# EAGLE schematic full_schema (EAGLE 9.6.2)
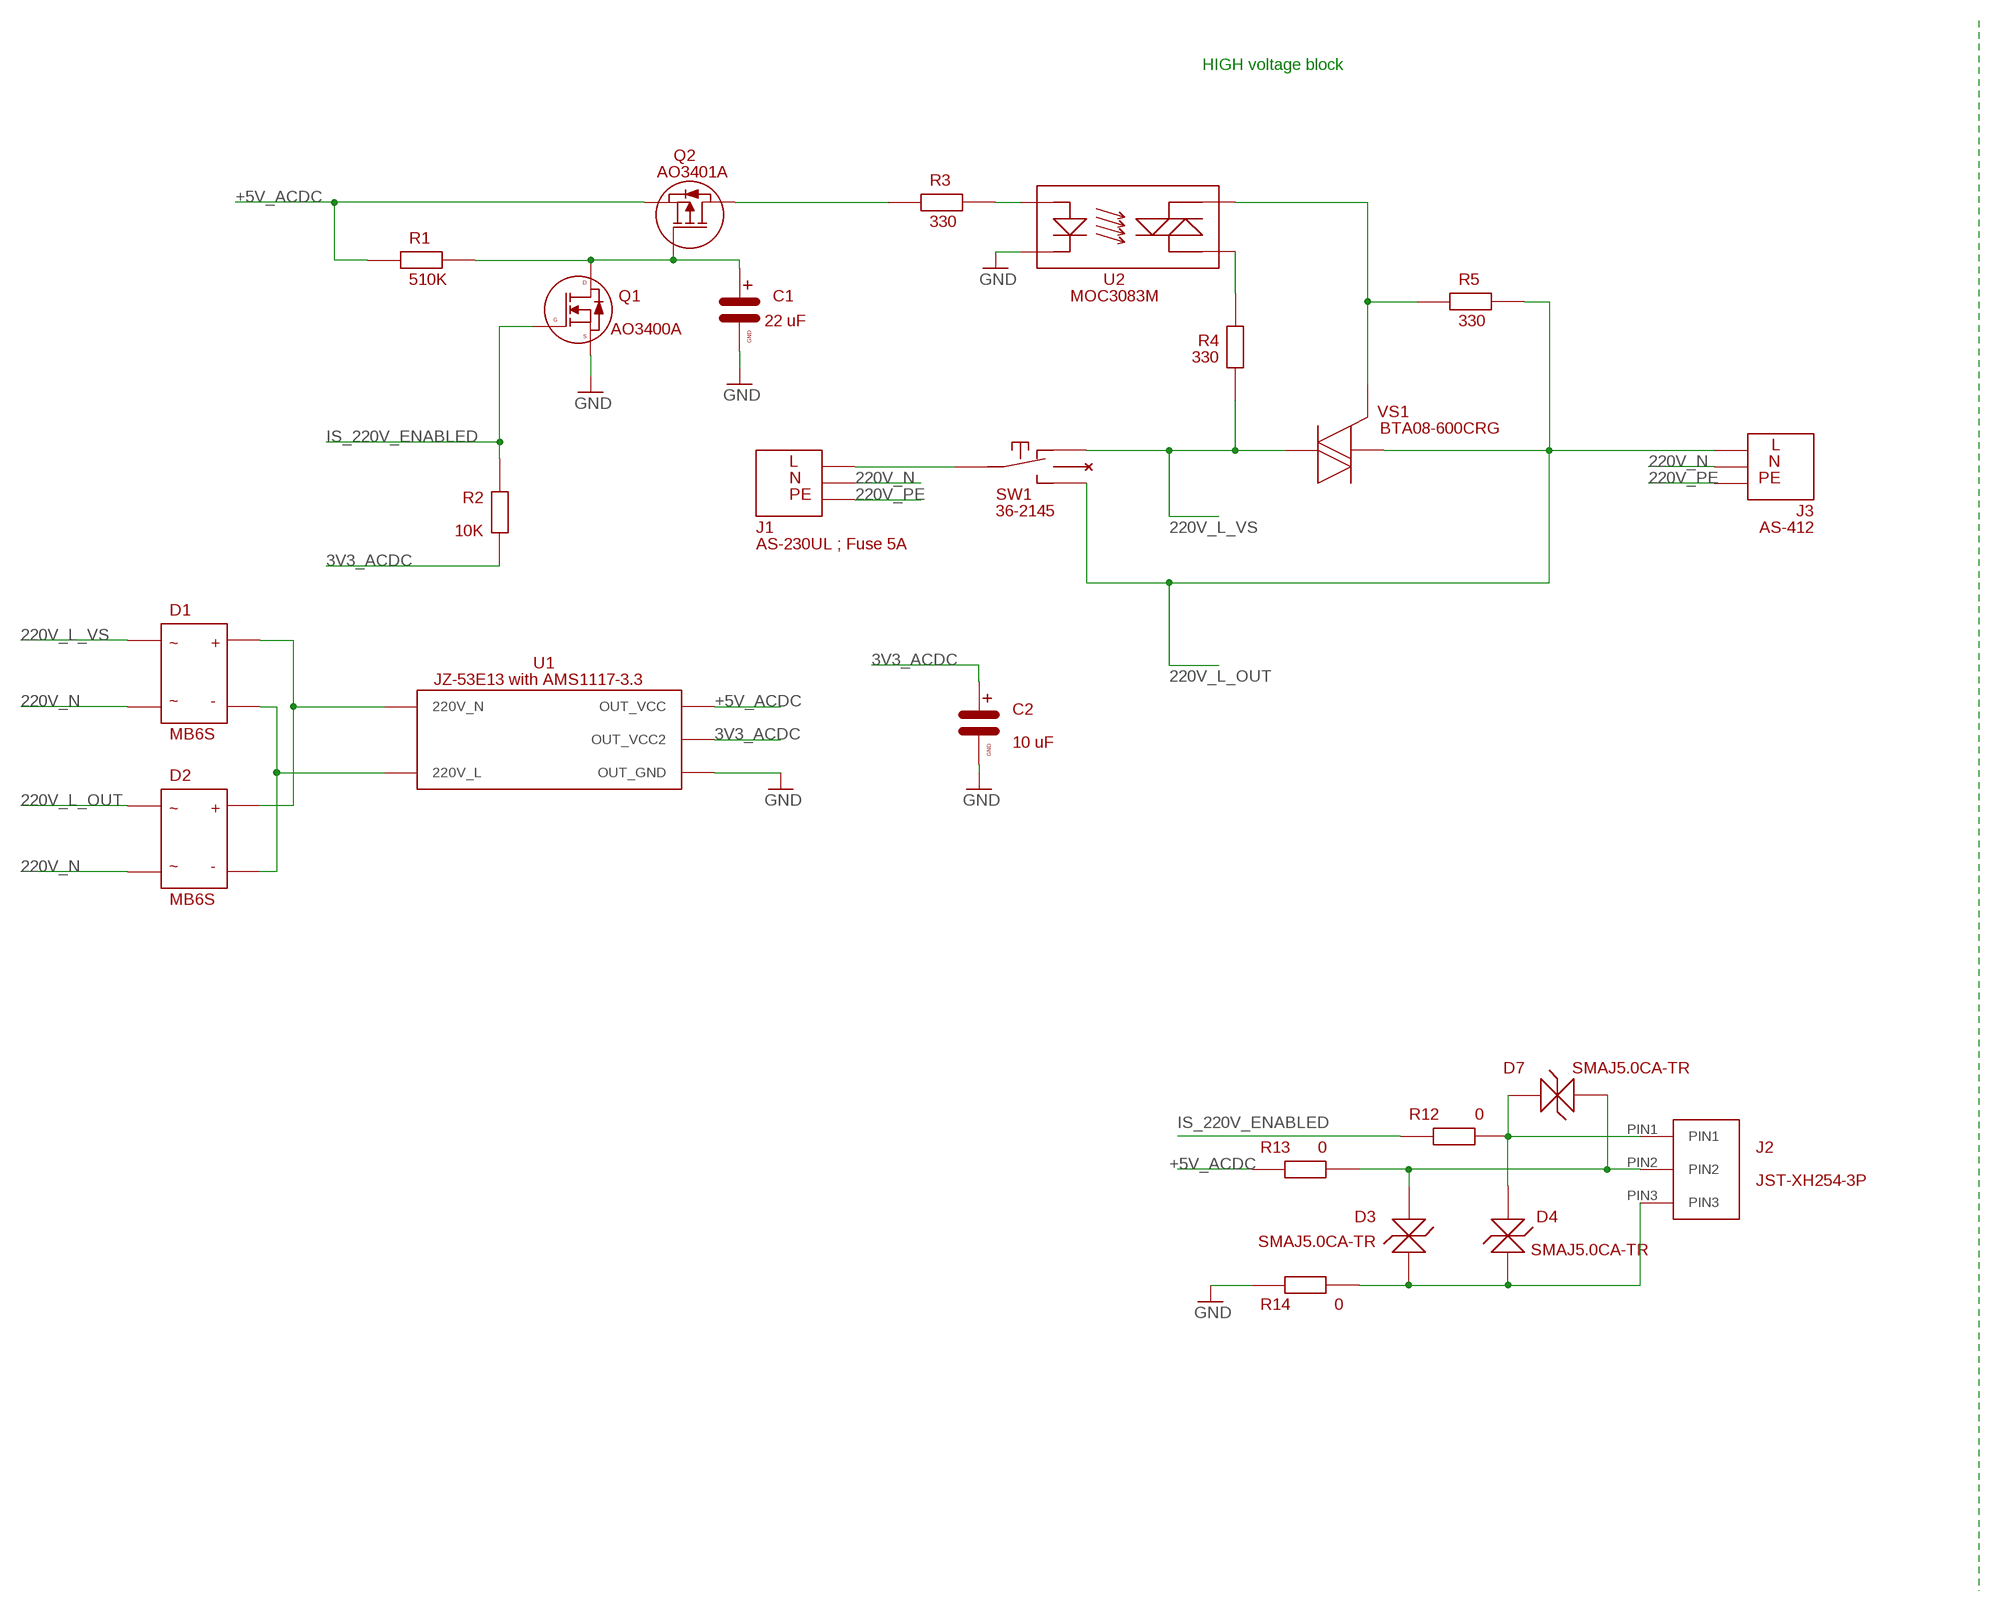
[diagram p0: schematic, sheet 1, part 1 of 2]
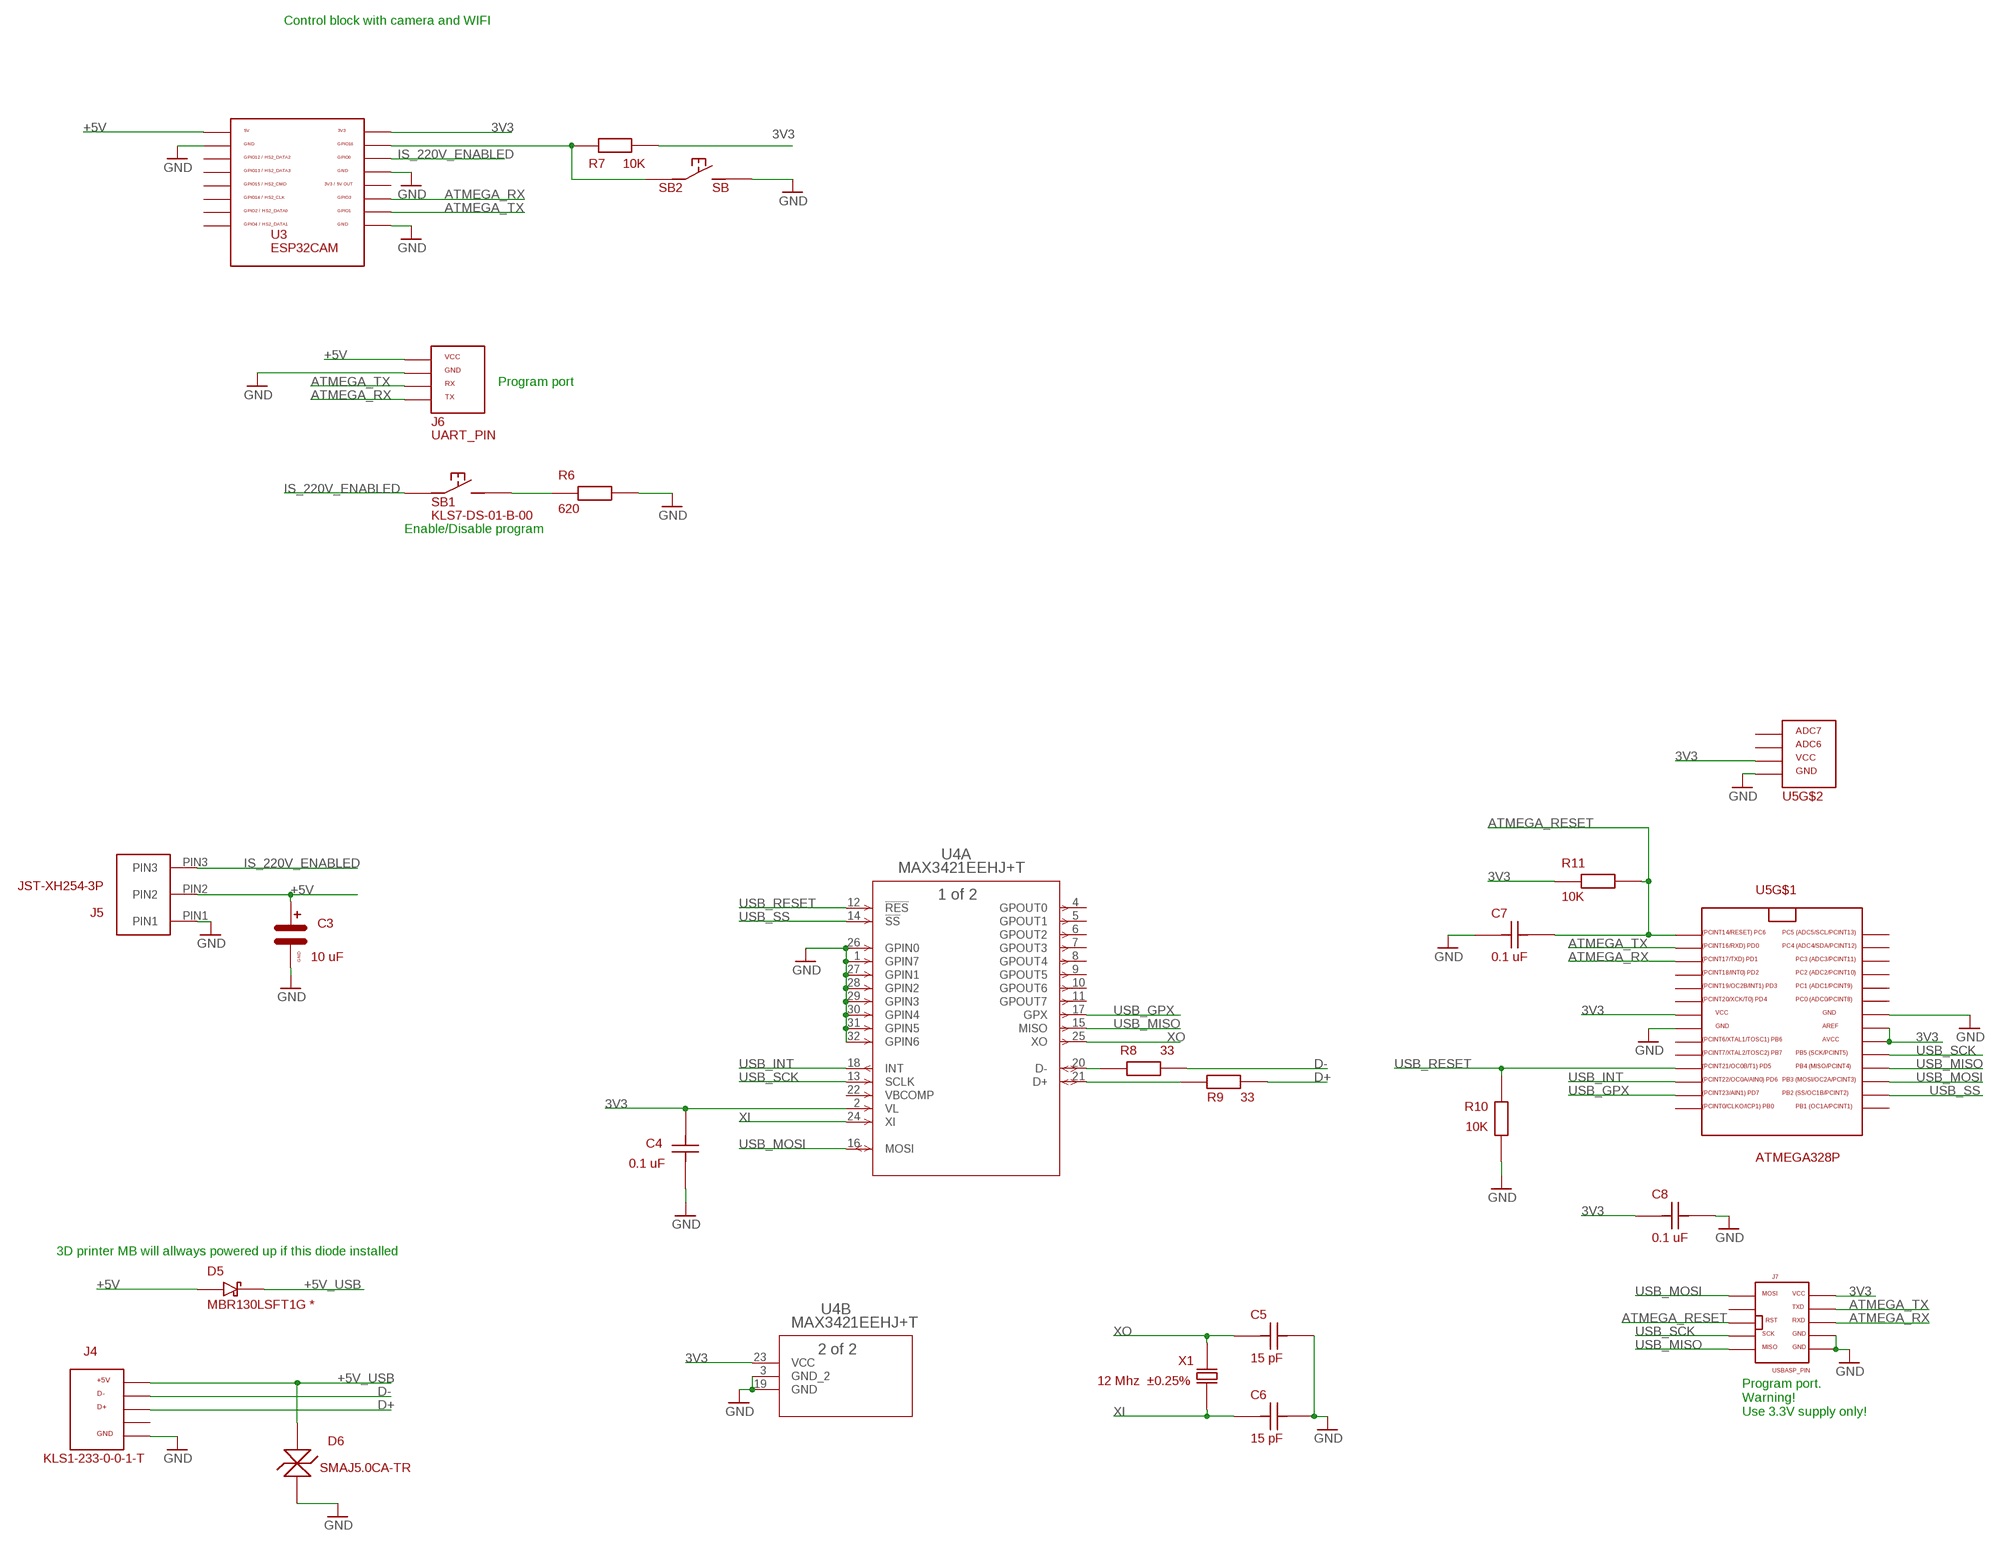
[diagram p1: schematic, sheet 1, part 2 of 2]

## Parts
C1  22 uF  CMINI-5X7  [C-MINI-5X7]
C2  10 uF  CMINI-5X7  [C-MINI-5X7]
C3  10 uF  CMINI-5X7  [C-MINI-5X7]
C4  0.1 uF  C-10805  [SMD_0805]
C5  15 pF  C-10805  [SMD_0805]
C6  15 pF  C-10805  [SMD_0805]
C7  0.1 uF  C-10805  [SMD_0805]
C8  0.1 uF  C-10805  [SMD_0805]
D1  MB6S  DIODE_BRIDGEMBS  [MBS]
D2  MB6S  DIODE_BRIDGEMBS  [MBS]
D3  SMAJ5.0CA-TR  D_ESDDO-214AC  [DO-214AC]
D4  SMAJ5.0CA-TR  D_ESDDO-214AC  [DO-214AC]
D5  MBR130LSFT1G *  D_SCHOTTKYSOD-123FL  [D-SOD-123FL]
D6  SMAJ5.0CA-TR  D_ESDDO-214AC  [DO-214AC]
D7  SMAJ5.0CA-TR  D_ESDDO-214AC  [DO-214AC]
J1  AS-230UL ; Fuse 5A  220V_CONNECTOREXT  [220V_CONNECTOR_EXTERNAL]
J2  JST-XH254-3P  [JST-XH254-3P]
J3  AS-412  220V_CONNECTOREXT  [220V_CONNECTOR_EXTERNAL]
J4  KLS1-233-0-0-1-T  J_MICROUSB  [MICROUSB]
J5  JST-XH254-3P  [JST-XH254-3P]
J6  UART_PIN  [UART_PIN]
J7  USBASP_PIN  [USBASP_PIN]
Q1  AO3400A  MOSFET_NSOT-23-3  [SOT-23-3]
Q2  AO3401A  MOSFET_PSOT-23-3  [SOT-23-3]
R1  510K  R0805  [SMD_0805]
R2  10K  R0805  [SMD_0805]
R3  330  R0805  [SMD_0805]
R4  330  R0805  [SMD_0805]
R5  330  R0805  [SMD_0805]
R6  620  R0805  [SMD_0805]
R7  10K  R0805  [SMD_0805]
R8  33  R0805  [SMD_0805]
R9  33  R0805  [SMD_0805]
R10  10K  R0805  [SMD_0805]
R11  10K  R0805  [SMD_0805]
R12  0  R0805  [SMD_0805]
R13  0  R0805  [SMD_0805]
R14  0  R0805  [SMD_0805]
SB1  KLS7-DS-01-B-00  SB-NOSWITCH  [SB-NC]
SB2  SB  SB-NOEXT_CONNECTOR  [SB-EXT]
SW1  36-2145  SWITCH_2  [SWITCH_2]
U1  JZ-53E13 with AMS1117-3.3  ACDC-2  [ACDC-30X20X18]
U2  MOC3083M  OPTRON  [DIP6]
U3  ESP32CAM  [ESP32CAM]
U4  MAX3421EEHJ+T  MAX3421EEHJ+21-0110B_MXM-M  [21-0110B_MXM-M]
U5  ATMEGA328P  ATMEGA328P-32PIN21-0110B_MXM-M  [21-0110B_MXM-M]
VS1  BTA08-600CRG  TRIACTO-220AB  [TO-220AB]
X1  12 Mhz ±0.25%  XHC-49U  [HC-49U]

## Nets
3V3: C4.P$2 C8.P$1 J7.VCC R7.P$1 R11.P$1 U3.P8(3V3) U4.2(A:VL) U4.23(B:VCC) U5.4(VCC) U5.6(VCC) U5.18(AVCC) U5.20(AREF)
3V3_ACDC: C2.PLUS(PIN_PLUS) R2.P$1 U1.OUT_VCC2
220V_L_CONTROL: R5.P$1 U2.P4(OUT_1) VS1.P3(GATE)
220V_L_OUT: D2.P1(AC1) J3.L R5.P$2 SW1.OUT2 VS1.P1(A1)
220V_L_VS: D1.P1(AC1) R4.P$1 SW1.OUT1 VS1.P2(A2)
220V_N: D1.P2(AC2) D2.P2(AC2) J1.N J3.N
220V_PE: J1.PE\(PE) J3.PE\(PE)
+5V: C3.PLUS(PIN_PLUS) D5.ANODE J5.PIN2 J6.VCC U3.P9(5V)
+5V_ACDC: Q2.P2(S) R1.P$1 R13.P$1 U1.OUT_VCC
+5V_USB: D5.CATHODE D6.P$2(P2) J4.+5V
ATMEGA_RESET: C7.P$2 J7.RST(RESET) R11.P$2 U5.29(PC6)
ATMEGA_RX: J6.TX J7.RXD U3.P3(GPIO3) U5.31(PD1)
ATMEGA_TX: J6.RX J7.TXD U3.P2(GPIO1) U5.30(PD0)
D+: J4.D+ R9.P$2
D-: J4.D- R8.P$2
GND: C1.MINUS(PIN_GND) C2.MINUS(PIN_GND) C3.MINUS(PIN_GND) C4.P$1 C5.P$2 C6.P$2 C7.P$1 C8.P$2 D1.P4(GND) D2.P4(GND) D6.P$1(P1) J4.GND J5.PIN1 J6.GND J7.GND J7.GND1 Q1.P2(S) R6.P$2 R10.P$1 R14.P$1 SB2.P$2 U1.220V_L U1.OUT_GND U2.P2(IN_CATHODE) U3.P1(GND2) U3.P5(GND1) U3.P10(GND) U4.1(A:GPIN7) U4.3(B:GND_2) U4.19(B:GND) U4.26(A:GPIN0) U4.27(A:GPIN1) U4.28(A:GPIN2) U4.29(A:GPIN3) U4.30(A:GPIN4) U4.31(A:GPIN5) U4.32(A:GPIN6) U5.3(GND) U5.5(GND) U5.21(GND1)
IS_220V_ENABLED: J5.PIN3 Q1.P1(G) R2.P$2 R12.P$1 SB1.P$1 U3.P6(GPIO0)
N$1: J1.L SW1.IN
N$2: D4.P$2(P2) D7.P$2(P2) J2.PIN1 R12.P$2
N$3: Q2.P3(D) R3.P$1
N$4: R8.P$1 U4.20(A:D-)
N$5: R3.P$2 U2.P1(IN_ANODE)
N$6: R4.P$2 U2.P6(OUT_2)
N$7: R7.P$2 SB2.P$1 U3.P7(GPIO16)
N$9: R6.P$1 SB1.P$2
N$10: D3.P$2(P2) D7.P$1(P1) J2.PIN2 R13.P$2
N$11: C1.PLUS(PIN_PLUS) Q1.P3(D) Q2.P1(G) R1.P$2
N$12: R9.P$1 U4.21(A:D+)
N$13: D3.P$1(P1) D4.P$1(P1) J2.PIN3 R14.P$2
USB_GPX: U4.17(A:GPX) U5.11(PD7)
USB_INT: U4.18(A:INT) U5.10(PD6)
USB_MISO: J7.MISO U4.15(A:MISO) U5.16(PB4)
USB_MOSI: J7.MOSI U4.16(A:MOSI) U5.15(PB3)
USB_RESET: R10.P$2 U4.12(A:!RES) U5.9(PD5)
USB_SCK: J7.SCK U4.13(A:SCLK) U5.17(PB5)
USB_SS: U4.14(A:!SS) U5.14(PB2)
VCC: D1.P3(VCC) D2.P3(VCC) U1.220V_N
XI: C6.P$1 U4.24(A:XI) X1.P$1
XO: C5.P$1 U4.25(A:XO) X1.P$2
Unconnected: J4.NC J7.NC1 U3.P4(3V3_5V_OUT) U3.P11(GPIO12) U3.P12(GPIO13) U3.P13(GPIO15) U3.P14(GPIO14) U3.P15(GPIO2) U3.P16(GPIO4) U4.4(A:GPOUT0) U4.5(A:GPOUT1) U4.6(A:GPOUT2) U4.7(A:GPOUT3) U4.8(A:GPOUT4) U4.9(A:GPOUT5) U4.10(A:GPOUT6) U4.11(A:GPOUT7) U4.22(A:VBCOMP) U5.1(PD3) U5.2(PD4) U5.7(PB6) U5.8(PB7) U5.12(PB0) U5.13(PB1) U5.19(ADC6) U5.22(ADC7) U5.23(PC0) U5.24(PC1) U5.25(PC2) U5.26(PC3) U5.27(PC4) U5.28(PC5) U5.32(PD2)

## Notes on the sheet
- HIGH voltage block | Control block with camera and WIFI
- Program port
- Enable/Disable program
- 3D printer MB will allways powered up if this diode installed
- Program port.
  Warning!
  Use 3.3V supply only!

## Library data of the parts
C1-C3 = my_devices:C
C4-C8 = my_devices:C-1
D1 D2 = my_devices:DIODE_BRIDGE
D3 D4 D6 D7 = my_devices:D_ESD
D5 = my_devices:D_SCHOTTKY
J1 J3 = my_devices:220V_CONNECTOR
J2 J5 = my_devices:JST-XH254-3P
J4 = my_devices:J_MICROUSB
J6 = my_devices:UART_PIN
J7 = my_devices:USBASP_PIN
Q1 = my_devices:MOSFET_N
Q2 = my_devices:MOSFET_P
R1-R14 = my_devices:R
SB1 SB2 = my_devices:SB-NO
SW1 = my_devices:SWITCH_2
U1 = my_devices:ACDC-2
U2 = my_devices:OPTRON
U3 = my_devices:ESP32CAM
U4 = my_devices:MAX3421EEHJ+; COPYRIGHT: Copyright (C) 2022 Ultra Librarian. All rights reserved.; MANUFACTURER_PART_NUMBER: MAX3421EEHJ+; MFR_NAME: Maxim Integrated Products
U5 = my_devices:ATMEGA328P-32PIN
VS1 = my_devices:TRIAC
X1 = my_devices:X